# EAGLE design main_board3 (EAGLE 7.2.0)
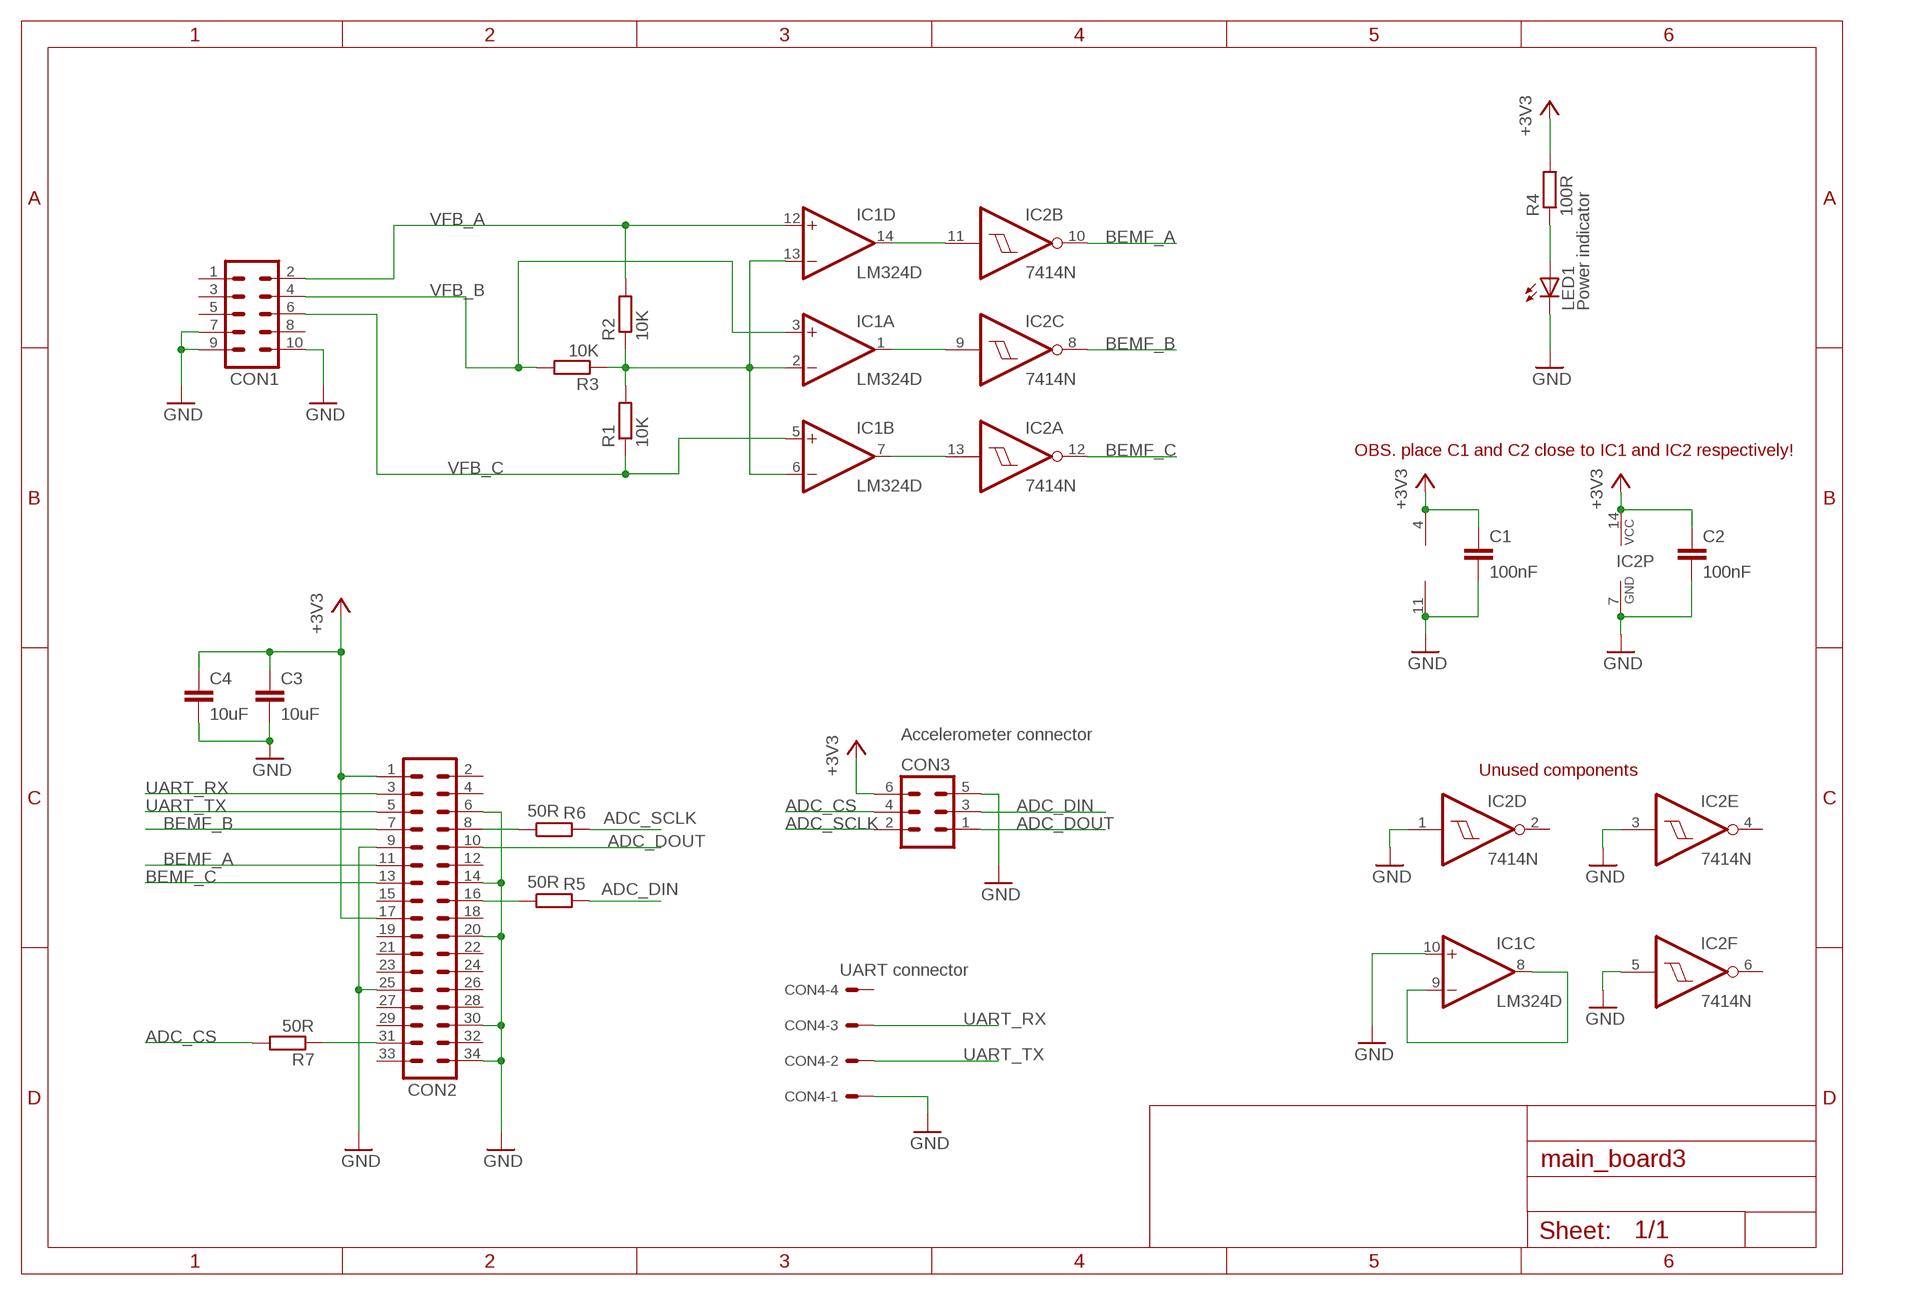
[diagram p0: schematic, sheet 1]

## Parts
C1  100nF  C-EUC0805K  [C0805K]
C2  100nF  C-EUC0805K  [C0805K]
C3  10uF  C-EUC1206K  [C1206K]
C4  10uF  C-EUC1206K  [C1206K]
CON1  MA05-2  [MA05-2]
CON2  MA17-2  [MA17-2]
CON3  Accelerometer connector  ML6  [ML6]
CON4  UART connector  22-27-2041-04  [6410-04]
IC1  LM324D  [SO14]
IC2  7414N  [DIL14]
LED1  Power indicator  LEDCHIP-LED0805  [CHIP-LED0805]
R1  10K  R-EU_R0805  [R0805]
R2  10K  R-EU_R0805  [R0805]
R3  10K  R-EU_R0805  [R0805]
R4  100R  R-EU_R0805  [R0805]
R5  50R  R-EU_R0805  [R0805]
R6  50R  R-EU_R0805  [R0805]
R7  50R  R-EU_R0805  [R0805]

## Nets
+3V3: C1.1 C2.1 C3.1 C4.1 CON2.1 CON2.17 CON3.6 IC1.4(P:V+) IC2.14(P:VCC) R4.2
ADC_CS: CON3.4 R7.2
ADC_DIN: CON3.3 R5.2
ADC_DOUT: CON2.10 CON3.1
ADC_SCLK: CON3.2 R6.2
BEMF_A: CON2.11 IC2.10(B:O)
BEMF_B: CON2.7 IC2.8(C:O)
BEMF_C: CON2.13 IC2.12(A:O)
GND: C1.2 C2.2 C3.2 C4.2 CON1.7 CON1.9 CON1.10 CON2.6 CON2.9 CON2.14 CON2.20 CON2.25 CON2.30 CON2.34 CON3.5 CON4.1 IC1.10(C:+IN) IC1.11(P:V-) IC2.1(D:I) IC2.3(E:I) IC2.5(F:I) IC2.7(P:GND) LED1.C
N$1: IC1.14(D:OUT) IC2.11(B:I)
N$2: IC1.1(A:OUT) IC2.9(C:I)
N$3: IC1.7(B:OUT) IC2.13(A:I)
N$4: IC1.2(A:-IN) IC1.6(B:-IN) IC1.13(D:-IN) R1.2 R2.1 R3.1
N$5: CON2.8 R6.1
N$6: CON2.16 R5.1
N$7: LED1.A R4.1
N$8: CON2.31 R7.1
N$9: IC1.8(C:OUT) IC1.9(C:-IN)
UART_RX: CON2.3 CON4.3
UART_TX: CON2.5 CON4.2
VFB_A: CON1.2 IC1.12(D:+IN) R2.2
VFB_B: CON1.4 IC1.3(A:+IN) R3.2
VFB_C: CON1.6 IC1.5(B:+IN) R1.1
Unconnected: CON1.1 CON1.3 CON1.5 CON1.8 CON2.2 CON2.4 CON2.12 CON2.15 CON2.18 CON2.19 CON2.21 CON2.22 CON2.23 CON2.24 CON2.26 CON2.27 CON2.28 CON2.29 CON2.32 CON2.33 CON4.4 IC2.2(D:O) IC2.4(E:O) IC2.6(F:O)

## Notes on the sheet
- OBS. place C1 and C2 close to IC1 and IC2 respectively!
- Unused components

## Library data of the parts
C1-C4 = rcl:C-EU: CAPACITOR, European symbol
CON1 = con-lstb:MA05-2: PIN HEADER; OC_FARNELL: unknown; OC_NEWARK: unknown
CON2 = con-lstb:MA17-2: PIN HEADER; OC_FARNELL: unknown; OC_NEWARK: unknown
CON3 = con-harting-ml:ML6: HARTING; OC_FARNELL: unknown; OC_NEWARK: unknown
CON4 = con-molex:22-?-04: CONNECTOR wire to board 2.54 mm (.1 inch) pitch header; OC_FARNELL: unknown; OC_NEWARK: unknown
IC1 = linear:LM324: OP AMP
IC2 = 74xx-eu:74*14: Hex schmitt trigger INVERTER
LED1 = led:LED: LED OSRAM: - CHIPLED LG R971, LG N971, LY N971, LG Q971, LY Q971, LO R971, LY R971 LH N974, LH R974 LS Q976, LO Q976, LY Q976 LO Q996 - Hyper CHIPLED LW Q18S LB Q993, LB Q99A, LB R99A - SideLED LS A670, LO A670, LY A670, LG A670, LP A670 LB A673, LV A673, LT A673, LW A673 LH A674 LY A675 LS A676, LA A676, LO A676, LY A676, LW A676 LS A679, LY A679, LG A679 - Hyper Micro SIDELED® LS Y876, LA Y876, LO Y876, LY Y876 LT Y87S - SmartLED LW L88C, LW L88S LB L89C, LB L89S, LG L890 LS L89K, LO L89K, LY L89K LS L896, LA L896, LO L896, LY L896 - TOPLED LS T670, LO T670, LY T670, LG T670, LP T670 LSG T670, LSP T670, LSY T670, LOP T670, LYG T670 LG T671, LOG T671, LSG T671 LB T673, LV T673, LT T673, LW T673 LH T674 LS T676, LA T676, LO T676, LY T676, LB T676, LH T676, LSB T676, LW T676 LB T67C, LV T67C, LT T67C, LS T67K, LO T67K, LY T67K, LW E67C LS E67B, LA E67B, LO E67B, LY E67B, LB E67C, LV E67C, LT E67C LW T67C LS T679, LY T679, LG T679 LS T770, LO T770, LY T770, LG T770, LP T770 LB T773, LV T773, LT T773, LW T773 LH T774 LS E675, LA E675, LY E675, LS T675 LS T776, LA T776, LO T776, LY T776, LB T776 LHGB T686 LT T68C, LB T68C - Hyper Mini TOPLED® LB M676 - Mini TOPLED Santana® LG M470 LS M47K, LO M47K, LY M47K Source: http://www.osram.convergy.de LUXEON: - LUMILED® LXK2-PW12-R00, LXK2-PW12-S00, LXK2-PW14-U00, LXK2-PW14-V00 LXK2-PM12-R00, LXK2-PM12-S00, LXK2-PM14-U00 LXK2-PE12-Q00, LXK2-PE12-R00, LXK2-PE12-S00, LXK2-PE14-T00, LXK2-PE14-U00 LXK2-PB12-K00, LXK2-PB12-L00, LXK2-PB12-M00, LXK2-PB14-N00, LXK2-PB14-P00, LXK2-PB14-Q00 LXK2-PR12-L00, LXK2-PR12-M00, LXK2-PR14-Q00, LXK2-PR14-R00 LXK2-PD12-Q00, LXK2-PD12-R00, LXK2-PD12-S00 LXK2-PH12-R00, LXK2-PH12-S00 LXK2-PL12-P00, LXK2-PL12-Q00, LXK2-PL12-R00 Source: www.luxeon.com KINGBRIGHT: KA-3528ASYC Source: www.kingbright.com
R1-R7 = rcl:R-EU_: RESISTOR, European symbol

## Net classes
1 power: width 0.61 mm

## Board
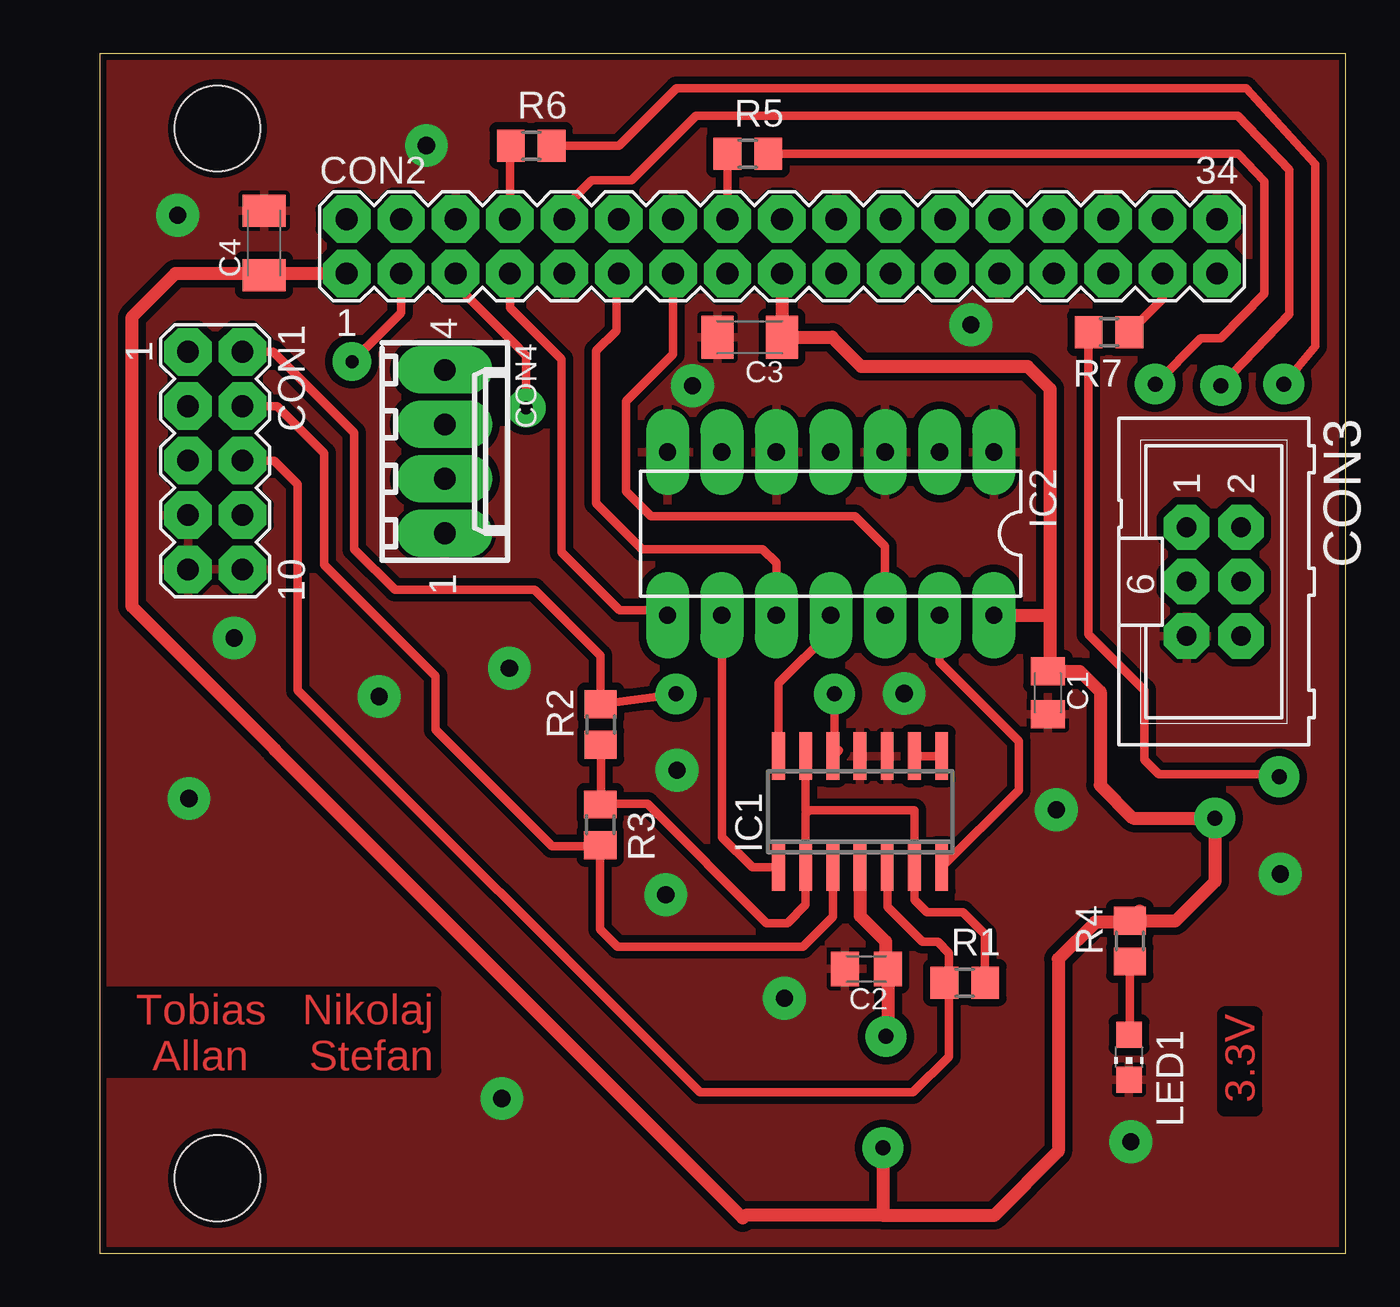
[diagram p1: board, top side]
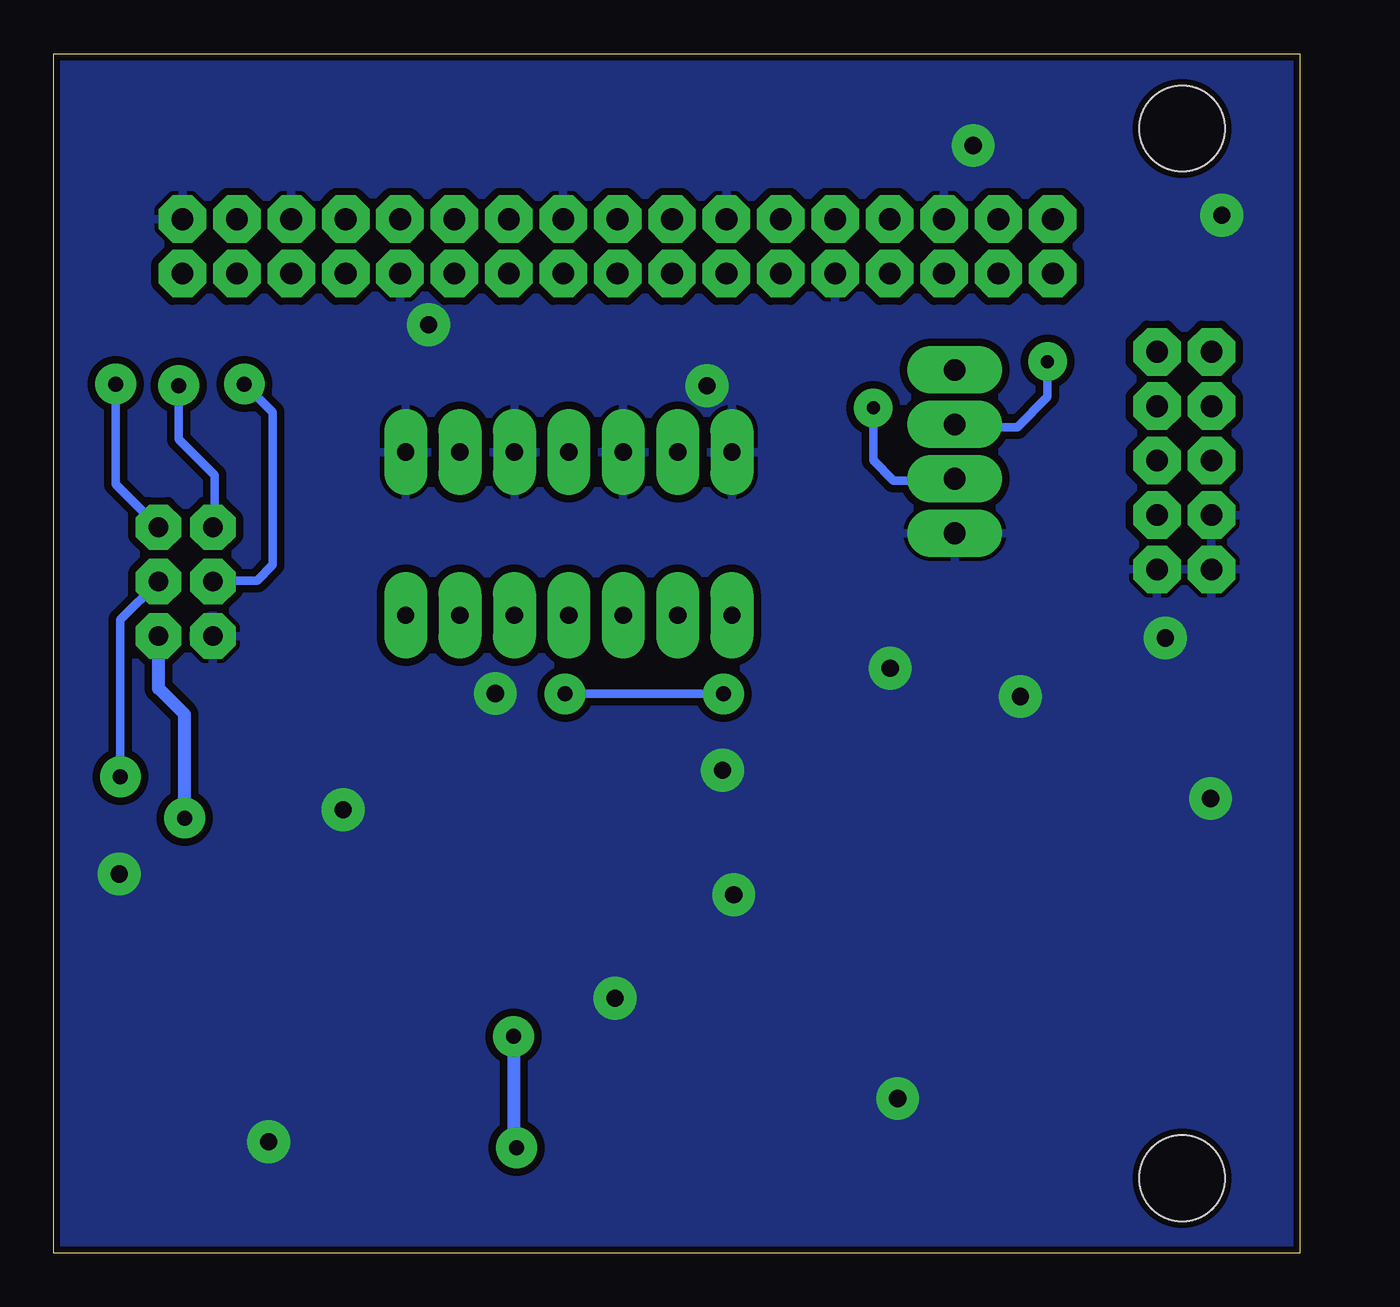
[diagram p2: board, bottom side, seen from below]

Size 58.2 x 56 mm. Coordinates in mm from the lower left corner, seen from the top.
Outline: 0,0 58.2,0 58.2,56 0,56 0,0
Copper layers (1*16): Top 0.035mm / dielectric 1.5mm / Bottom 0.035mm
Design rules "PCB-POOL Standard *": minimum track width 0.15mm, minimum drill 0.3mm, track to track 0.35mm, track to pad 0.3mm, pad to pad 0.2mm, via to via 0.15mm, smd to smd 0.15mm, copper to edge 0.3mm, drill to drill 0.2mm, minimum pad ring 0.6mm, minimum via ring 0.6mm, stop-mask expansion 0.075mm, vias tented up to drill 0mil, thermal gap 0.2mm
Holes 4 mm at 5.5,52.5 63.5,52.5 5.5,3.5 63.5,3.5

### Footprints (pad centres in the part's own frame; a part is rotated, then mirrored left to right if it is on the bottom)
C0805K = smd 1.3 x 1.6: 1 -1,0; 2 1,0
C1206K = smd 1.5 x 2: 1 -1.5,0; 2 1.5,0
MA05-2 = drill 1.016 octagon: 1 -5.08,-1.27; 2 -5.08,1.27; 3 -2.54,-1.27; 4 -2.54,1.27; 5 0,-1.27; 6 0,1.27; 7 2.54,-1.27; 8 2.54,1.27; 9 5.08,-1.27; 10 5.08,1.27
MA17-2 = drill 1.016 octagon: 1 -20.32,-1.27; 2 -20.32,1.27; 3 -17.78,-1.27; 4 -17.78,1.27; 5 -15.24,-1.27; 6 -15.24,1.27; 7 -12.7,-1.27; 8 -12.7,1.27; 9 -10.16,-1.27; 10 -10.16,1.27; 11 -7.62,-1.27; 12 -7.62,1.27; 13 -5.08,-1.27; 14 -5.08,1.27; 15 -2.54,-1.27; 16 -2.54,1.27; 17 0,-1.27; 18 0,1.27; 19 2.54,-1.27; 20 2.54,1.27; 21 5.08,-1.27; 22 5.08,1.27; 23 7.62,-1.27; 24 7.62,1.27; 25 10.16,-1.27; 26 10.16,1.27; 27 12.7,-1.27; 28 12.7,1.27; 29 15.24,-1.27; 30 15.24,1.27; 31 17.78,-1.27; 32 17.78,1.27; 33 20.32,-1.27; 34 20.32,1.27
ML6 = drill 0.914 octagon: 1 -2.54,-1.27; 2 -2.54,1.27; 3 0,-1.27; 4 0,1.27; 5 2.54,-1.27; 6 2.54,1.27
6410-04 = drill 1.016 long: 1 3.81,0; 2 1.27,0; 3 -1.27,0; 4 -3.81,0
SO14 = smd 0.6 x 2.2: 1 -3.81,-2.6; 2 -2.54,-2.6; 3 -1.27,-2.6; 4 0,-2.6; 5 1.27,-2.6; 6 2.54,-2.6; 7 3.81,-2.6; 8 3.81,2.6; 9 2.54,2.6; 10 1.27,2.6; 11 0,2.6; 12 -1.27,2.6; 13 -2.54,2.6; 14 -3.81,2.6
DIL14 = drill 0.813 long: 1 -7.62,-3.81; 2 -5.08,-3.81; 3 -2.54,-3.81; 4 0,-3.81; 5 2.54,-3.81; 6 5.08,-3.81; 7 7.62,-3.81; 8 7.62,3.81; 9 5.08,3.81; 10 2.54,3.81; 11 0,3.81; 12 -2.54,3.81; 13 -5.08,3.81; 14 -7.62,3.81
CHIP-LED0805 = smd 1.2 x 1.2: A 0,-1.05; C 0,1.05
R0805 = smd 1.3 x 1.5: 1 -0.95,0; 2 0.95,0

### Placement (x,y rotation side)
C1  44.28,26.16 270 top
C2  35.81,13.27 180 top
C3  30.36,42.76 180 top
C4  7.68,47.16 90 top
CON1  5.4,37 270 top
CON2  31.86,47 0 top
CON3  52.03,31.35 270 top
CON4  16.12,37.42 270 top
IC1  35.51,20.61 0 top
IC2  34.14,33.59 180 top
LED1  48.07,9.15 180 top
R1  40.4,12.63 0 top
R2  23.4,24.68 90 top
R3  23.38,20 270 top
R4  48.11,14.57 90 top
R5  30.27,51.32 0 top
R6  20.15,51.7 0 top
R7  47.13,42.99 180 top

### Tracks (layer width: path | path; a pad name or v marks a point on that pad's centre or on a via)
+3V3  (via drill 0.7 pad 1.4)
  Top 0.61: CON2.17 C3.1 34.2,42.76 35.56,41.4 43.33,41.4 44.38,40.35 44.38,29.92 | 44.38,29.92 44.38,27.26 C1.1 45.77,27.16 46.72,26.21 46.72,21.85 48.26,20.31 v52.08,20.31 52.08,17.35 50.23,15.5 48.13,15.5 R4.2 | IC2.14 44.24,29.78 44.38,29.92 | C4.1 7.75,45.73 CON2.1 3.54,45.73 1.5,43.69 1.5,30.2 8.18,23.52 8.18,23.5 30.03,1.65 30.15,1.77 36.58,1.77 | R4.2 48.05,15.46 46.49,15.46 44.77,13.74 44.77,4.75 41.78,1.76 36.59,1.76 36.58,1.77 | 48.56,15.97 R4.2 | IC1.4 35.51,15.75 36.7,14.56 36.7,13.38 C2.1 36.81,10.21 v36.72,10.12 | v36.58,4.92 36.58,1.77
  Bottom 0.61: v52.08,20.31 52.08,25.15 53.3,26.37 CON3.6 | v36.72,10.12 36.72,5.06 v36.58,4.92
ADC_CS  (via drill 0.7 pad 1.4)
  Top 0.406: R7.2 46.18,28.89 48.79,26.28 48.79,23.04 49.46,22.37 54.95,22.37 v55.08,22.24
  Bottom 0.406: v55.08,22.24 55.08,29.57 CON3.4
ADC_DIN  (via drill 0.7 pad 1.4)
  Top 0.406: R5.2 53.17,51.32 54.38,50.04 54.38,44.79 52.36,42.7 51.42,42.7 v49.29,40.57
  Bottom 0.406: v49.29,40.57 47.97,39.25 47.97,32.13 48.7,31.4 50.71,31.4 CON3.3
ADC_DOUT  (via drill 0.7 pad 1.4)
  Top 0.406: CON2.10 21.7,48.81 22.97,50.08 24.85,50.08 27.86,53.09 53.16,53.09 55.56,50.57 55.56,43.82 v52.36,40.5
  Bottom 0.406: v52.36,40.5 52.36,38 50.68,36.32 50.68,33.97 CON3.1
ADC_SCLK  (via drill 0.7 pad 1.4)
  Top 0.406: R6.2 24.26,51.7 26.93,54.37 53.54,54.37 56.76,50.84 56.76,42.34 v55.3,40.57 | 53.25,33.94 CON3.2
  Bottom 0.406: v55.3,40.57 55.3,35.89 CON3.2
BEMF_A
  Top 0.406: IC2.10 31.6,32.23 30.96,32.87 25.32,32.87 23.19,35 23.19,42.12 24.14,43.07 24.14,45.63 CON2.11
BEMF_B
  Top 0.406: CON2.7 19.16,44.14 21.58,41.72 21.58,32.71 24.27,30.02 26.28,30.02 IC2.8
BEMF_C
  Top 0.406: IC2.12 36.68,33.01 35.28,34.41 25.75,34.41 24.58,35.58 24.58,39.77 26.78,41.97 CON2.13
GND  (via drill 0.8 pad 1.4)
  other vias: 19.13,27.3 44.68,20.7 3.65,48.45 15.26,51.71 40.69,43.34 48.16,5.2 18.78,7.22 6.28,28.72 4.17,21.23 13.05,25.99 27.68,40.5 31.98,11.9 55.13,17.7 26.97,22.55 26.44,16.73 37.57,26.13
  pour Bottom: -10.1,63.71 67.38,63.71 67.38,-3.57 -10.1,-3.57
  pour Top: -12.64,64.98 69.53,64.98 69.53,-6.36 -12.64,-6.36
N$1
  Top 0.406: IC1.14 31.7,26.6 34.14,29.04 IC2.11
N$2
  Top 0.406: IC1.1 30.48,18.01 29.07,19.42 IC2.9
N$3
  Top 0.406: IC2.13 39.22,27.6 42.92,23.9 42.92,21.61 IC1.7
N$4
  Top 0.406: IC1.13 32.95,23.21 32.95,20.67 33.13,20.67 | 33.13,20.67 38.05,20.67 IC1.6 38.05,16.51 38.64,15.92 40.32,15.92 41.35,14.89 R1.2 | 33.13,20.67 32.97,20.51 IC1.2 32.97,16.27 32.11,15.41 31.15,15.41 25.58,20.98 23.41,20.98 | R2.1 23.38,23.24 23.41,23.21 23.41,20.98 | 23.41,20.98 R3.1
N$5
  Top 0.406: CON2.8 19.16,51.66 R6.1
N$6
  Top 0.406: CON2.16 R5.1
N$7
  Top 0.406: R4.1 48.11,10.24 LED1.A
N$8
  Top 0.406: CON2.31 49.64,44.55 R7.1
N$9
  Top 0.406: IC1.8 IC1.9
UART_RX  (via drill 0.6)
  Top 0.406: CON2.3 14.08,43.91 v11.79,41.62
  Bottom 0.406: v11.79,41.62 11.79,39.97 13.2,38.56 16.14,38.56 CON4.3
UART_TX  (via drill 0.6)
  Top 0.406: CON2.5 16.62,45.21 19.62,42.21 19.62,42.2 19.92,41.9 v19.92,39.46
  Bottom 0.406: v19.92,39.46 19.92,37.02 18.97,36.07 16.2,36.07 CON4.2
VFB_A  (via drill 0.7 pad 1.4)
  Top 0.406: 34.52,23.49 IC1.12 34.31,23.28 v34.31,26.11 | v26.92,26.11 v26.91,26.1 R2.2 23.4,27.88 20.32,30.96 13.79,30.96 11.88,32.87 11.88,38.3 8.1,42.08 CON1.2
  Bottom 0.406: v26.92,26.11 v34.31,26.11
VFB_B
  Top 0.406: IC1.3 34.24,15.7 32.85,14.31 24.19,14.31 23.38,15.12 R3.2 23.33,19 21.12,19 15.69,24.43 15.69,26.93 10.48,32.14 10.48,37.34 8.28,39.54 CON1.4
VFB_C
  Top 0.406: CON1.6 8.14,37 9.25,35.89 9.25,26.29 28.03,7.51 37.99,7.51 39.65,9.17 39.65,12.43 R1.1 | IC1.5 36.78,16.17 38.42,14.53 39.15,14.53 39.67,14.01 39.67,12.85 R1.1 | 39.43,12.61 R1.1 | 39.4,12.58 R1.1

### Text on the board
Top: Tobias Nikolaj / Allan Stefan | 3.3V